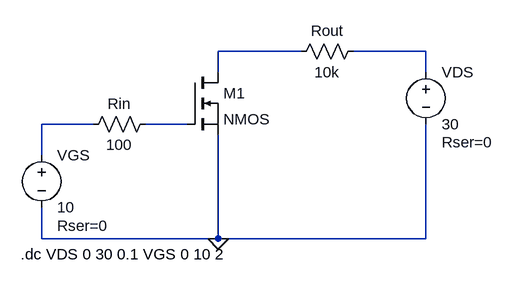
[diagram p0: schematic NMOS Transfer Characteristics.asc]
NMOS Transfer Characteristics.asc, the LTspice schematic file:
Version 4.1
SHEET 1 880 680
WIRE 352 80 224 80
WIRE 544 80 432 80
WIRE 224 112 224 80
WIRE 544 112 544 80
WIRE 32 192 -48 192
WIRE 176 192 112 192
WIRE -48 240 -48 192
WIRE -48 368 -48 320
WIRE 224 368 224 208
WIRE 224 368 -48 368
WIRE 544 368 544 192
WIRE 544 368 224 368
FLAG 224 368 0
SYMBOL nmos 176 112 R0
SYMATTR InstName M1
SYMBOL voltage -48 224 R0
WINDOW 123 0 0 Left 0
WINDOW 39 24 124 Left 2
SYMATTR InstName VGS
SYMATTR Value 10
SYMATTR SpiceLine Rser=0
SYMBOL voltage 544 96 R0
WINDOW 123 0 0 Left 0
WINDOW 39 24 124 Left 2
SYMATTR InstName VDS
SYMATTR Value 30
SYMATTR SpiceLine Rser=0
SYMBOL res 448 64 R90
WINDOW 0 0 56 VBottom 2
WINDOW 3 32 56 VTop 2
SYMATTR InstName Rout
SYMATTR Value 10k
SYMBOL res 128 176 R90
WINDOW 0 0 56 VBottom 2
WINDOW 3 32 56 VTop 2
SYMATTR InstName Rin
SYMATTR Value 100
TEXT -80 392 Left 2 !.dc VDS 0 30 0.1 VGS 0 10 2

The netlist it stands for:
* NMOS Transfer Characteristics.asc
M1 N001 N004 0 0 NMOS
VGS N003 0 10 Rser=0
VDS N002 0 30 Rser=0
Rout N002 N001 10k
Rin N004 N003 100
.model NMOS NMOS
.model PMOS PMOS
.lib standard.mos
.dc VDS 0 30 0.1 VGS 0 10 2
.backanno
.end